# EAGLE design STorM32 NT mpu module v007-mpu6000 (EAGLE 6.5.0)
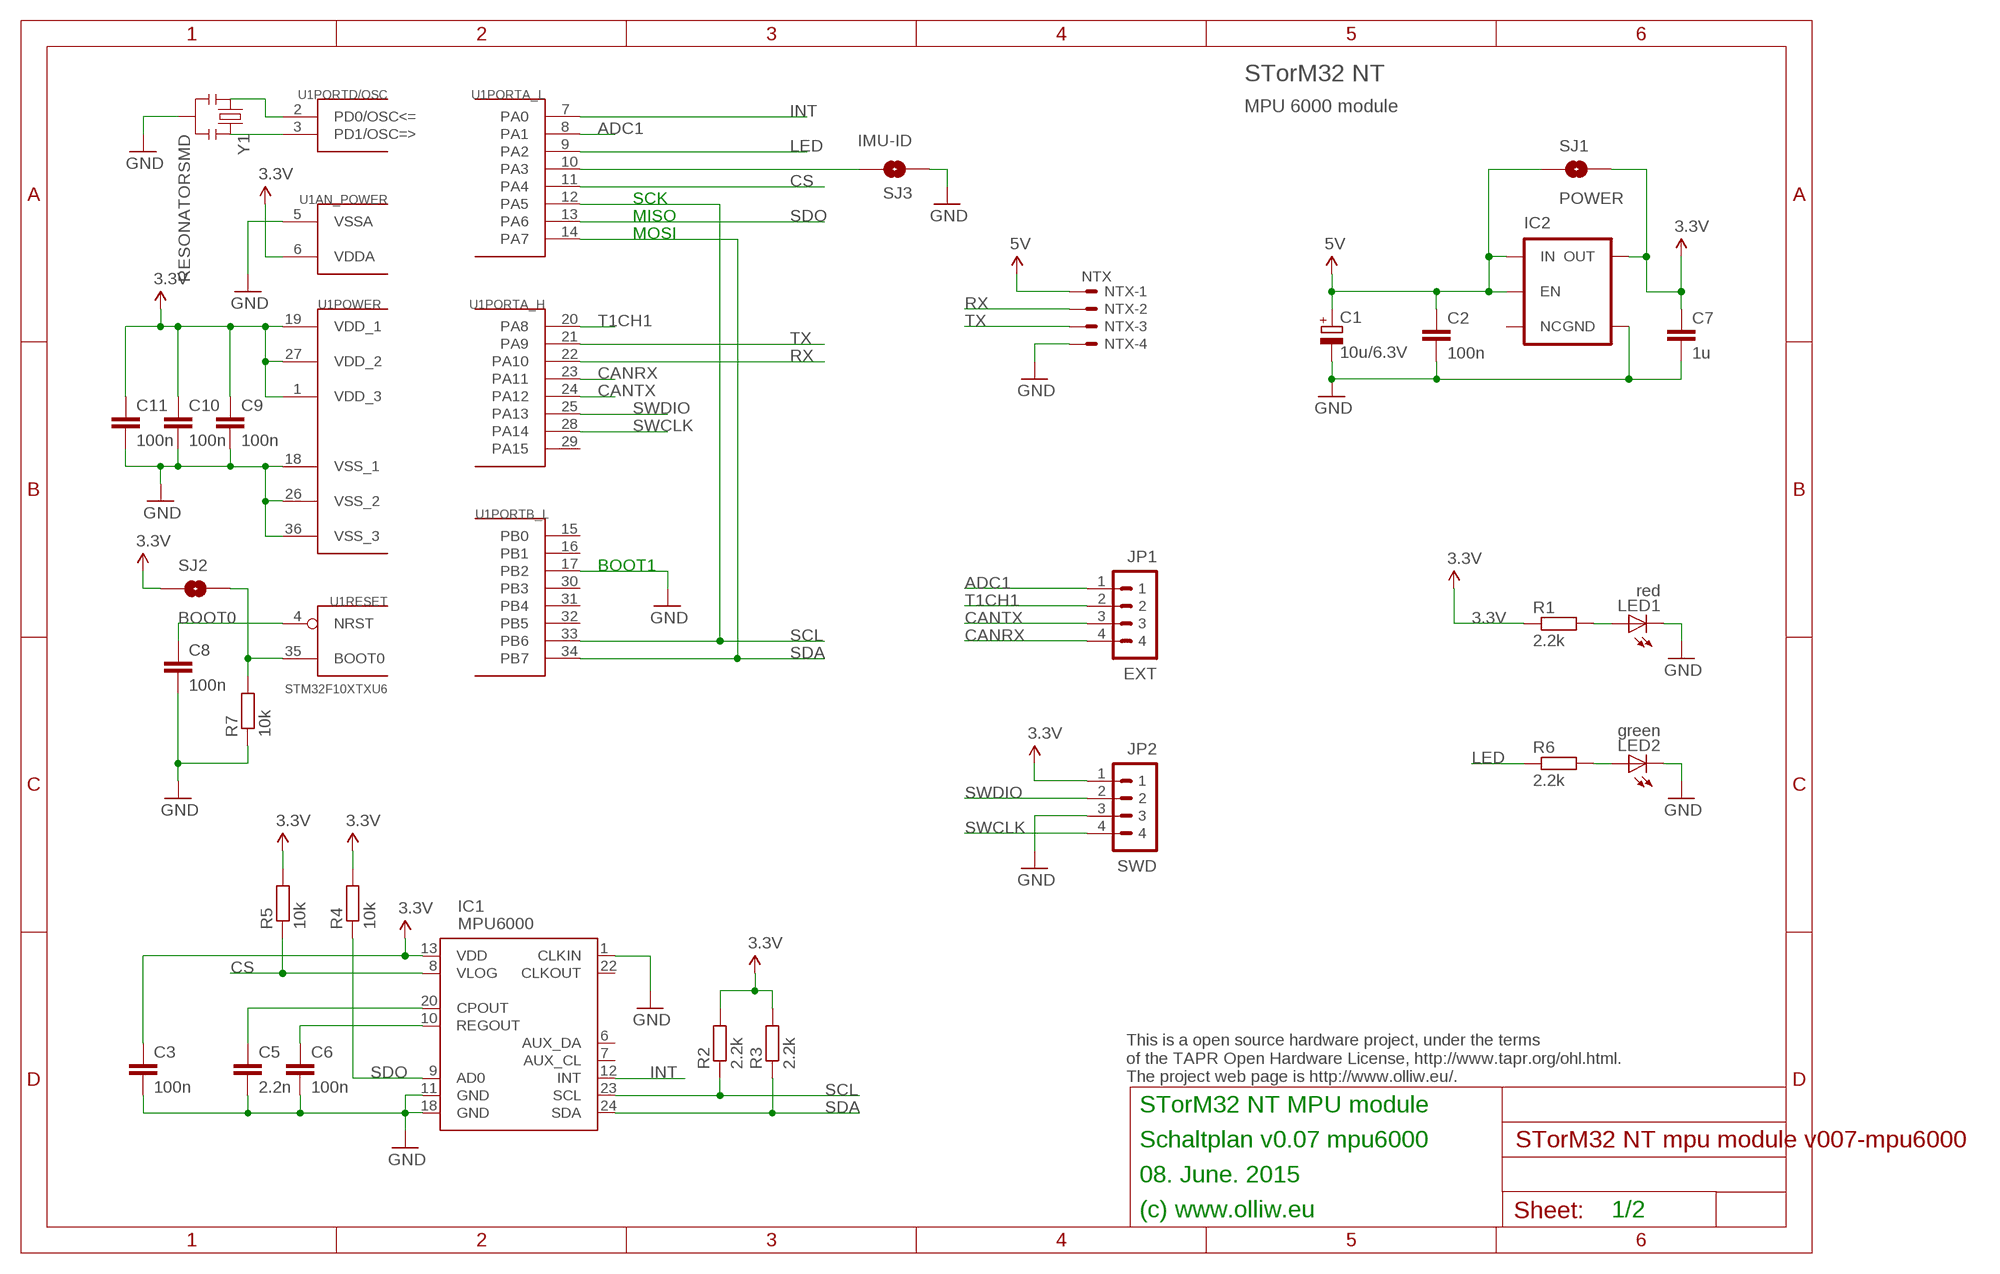
[diagram p0: schematic, sheet 1]

## Parts
C1  10u/6.3V  CPOL-EUSMCB  [SMC_B]
C2  100n  C-EUC0603  [C0603]
C3  100n  C-EUC0603  [C0603]
C5  2.2n  C-EUC0603  [C0603]
C6  100n  C-EUC0603  [C0603]
C7  1u  C-EUC0603  [C0603]
C8  100n  C-EUC0402  [C0402]
C9  100n  C-EUC0603  [C0603]
C10  100n  C-EUC0402  [C0402]
C11  100n  C-EUC0603  [C0603]
IC1  MPU6000  IMU3000  [QFN-24]
IC2  V_REG_TPS76433SOT23-5  [SOT23-5]
JP1  EXT  P4X1_1P27-OCT_BILEX  [4X1_1P27_OCT_BILEX]
JP2  SWD  P4X1_1P27-OCT_BILEX  [4X1_1P27_OCT_BILEX]
LED1  red  LEDCHIPLED_0603  [CHIPLED_0603]
LED2  green  LEDCHIPLED_0603  [CHIPLED_0603]
NTX  NTX  SM04B-SRSS-TB  [SM04B-SRSS-TB]
R1  2.2k  R-EU_R0603  [R0603]
R2  2.2k  R-EU_R0603  [R0603]
R3  2.2k  R-EU_R0603  [R0603]
R4  10k  R-EU_R0603  [R0603]
R5  10k  R-EU_R0603  [R0603]
R6  2.2k  R-EU_R0603  [R0603]
R7  10k  R-EU_R0603  [R0603]
SJ1  POWER  SOLDERJUMPERNO  [SJ_2S-NO]
SJ2  BOOT0  SOLDERJUMPERNO  [SJ_2S-NO]
SJ3  IMU-ID  SOLDERJUMPERNO  [SJ_2S-NO]
U1  STM32F10XTXU6  [VFQFPN36]
Y1  RESONATORSMD  [RESONATOR-SMD]

## Nets
3.3V: C3.1 C7.1 C9.1 C10.1 C11.1 IC1.13(VDD) IC2.5(OUT) JP2.1 R1.1 R2.2 R3.2 R4.2 R5.2 SJ1.2 SJ2.1 U1.1(POWER:VDD_3) U1.6(AN_POWER:VDDA) U1.19(POWER:VDD_1) U1.27(POWER:VDD_2)
5V: C1.+ C2.1 IC2.1(IN) IC2.3(EN) NTX.1 SJ1.1
ADC1: JP1.1 U1.8(PORTA_L:PA1)
CANRX: JP1.4 U1.23(PORTA_H:PA11)
CANTX: JP1.3 U1.24(PORTA_H:PA12)
CS: IC1.8(VLOG) R5.1 U1.11(PORTA_L:PA4)
GND: C1.- C2.2 C3.2 C5.2 C6.2 C7.2 C8.2 C9.2 C10.2 C11.2 IC1.1(CLKIN) IC1.11(GND) IC1.18(GND) IC2.2(GND) JP2.3 LED1.C LED2.C NTX.4 R7.1 SJ3.1 U1.5(AN_POWER:VSSA) U1.17(PORTB_L:PB2) U1.18(POWER:VSS_1) U1.26(POWER:VSS_2) U1.36(POWER:VSS_3) Y1.2
INT: IC1.12(INT) U1.7(PORTA_L:PA0)
LED: R6.1 U1.9(PORTA_L:PA2)
N$1: C8.1 U1.4(RESET:NRST)
N$2: LED2.A R6.2
N$3: R7.2 SJ2.2 U1.35(RESET:BOOT0)
N$5: U1.2(PORTD/OSC:PD0/OSC<=) Y1.1
N$6: U1.3(PORTD/OSC:PD1/OSC=>) Y1.3
N$9: LED1.A R1.2
N$20: C6.1 IC1.10(REGOUT)
N$24: C5.1 IC1.20(CPOUT)
RX: NTX.2 U1.22(PORTA_H:PA10)
RX2: SJ3.2 U1.10(PORTA_L:PA3)
SCL: IC1.23(SCL) R2.1 U1.12(PORTA_L:PA5) U1.33(PORTB_L:PB6)
SDA: IC1.24(SDA) R3.1 U1.14(PORTA_L:PA7) U1.34(PORTB_L:PB7)
SDO: IC1.9(AD0) R4.1 U1.13(PORTA_L:PA6)
SWCLK: JP2.4 U1.28(PORTA_H:PA14)
SWDIO: JP2.2 U1.25(PORTA_H:PA13)
T1CH1: JP1.2 U1.20(PORTA_H:PA8)
TX: NTX.3 U1.21(PORTA_H:PA9)
Unconnected: IC1.6(AUX_DA) IC1.7(AUX_CL) IC1.22(CLKOUT) IC2.4(NC) U1.15(PORTB_L:PB0) U1.16(PORTB_L:PB1) U1.29(PORTA_H:PA15) U1.30(PORTB_L:PB3) U1.31(PORTB_L:PB4) U1.32(PORTB_L:PB5)

## Notes on the sheet
- STorM32 NT
- MPU 6000 module
- SCK
- MISO
- MOSI
- BOOT1
- This is a open source hardware project, under the terms
  of the TAPR Open Hardware License, http://www.tapr.org/ohl.html.
  The project web page is http://www.olliw.eu/.
- STorM32 NT MPU module
- Schaltplan v0.07 mpu6000
- 08. June. 2015
- (c) www.olliw.eu | 1/2

## Library data of the parts
C1 = rcl:CPOL-EU: POLARIZED CAPACITOR, European symbol
C2 C3 C5-C11 = rcl:C-EU: CAPACITOR, European symbol
IC1 = # SparkFun2:IMU3000
IC2 = # SparkFun2:V_REG_TPS76433: Voltage Regulator Older TI part. LDO 150mA regulator. No output by-pass cap option. See V_REG_LDO for a better part.
JP1 JP2 = # stdlib:P4X1_1P27
LED1 LED2 = led:LED: LED OSRAM: - CHIPLED LG R971, LG N971, LY N971, LG Q971, LY Q971, LO R971, LY R971 LH N974, LH R974 LS Q976, LO Q976, LY Q976 LO Q996 - Hyper CHIPLED LW Q18S LB Q993, LB Q99A, LB R99A - SideLED LS A670, LO A670, LY A670, LG A670, LP A670 LB A673, LV A673, LT A673, LW A673 LH A674 LY A675 LS A676, LA A676, LO A676, LY A676, LW A676 LS A679, LY A679, LG A679 - Hyper Micro SIDELED® LS Y876, LA Y876, LO Y876, LY Y876 LT Y87S - SmartLED LW L88C, LW L88S LB L89C, LB L89S, LG L890 LS L89K, LO L89K, LY L89K LS L896, LA L896, LO L896, LY L896 - TOPLED LS T670, LO T670, LY T670, LG T670, LP T670 LSG T670, LSP T670, LSY T670, LOP T670, LYG T670 LG T671, LOG T671, LSG T671 LB T673, LV T673, LT T673, LW T673 LH T674 LS T676, LA T676, LO T676, LY T676, LB T676, LH T676, LSB T676, LW T676 LB T67C, LV T67C, LT T67C, LS T67K, LO T67K, LY T67K, LW E67C LS E67B, LA E67B, LO E67B, LY E67B, LB E67C, LV E67C, LT E67C LW T67C LS T679, LY T679, LG T679 LS T770, LO T770, LY T770, LG T770, LP T770 LB T773, LV T773, LT T773, LW T773 LH T774 LS E675, LA E675, LY E675, LS T675 LS T776, LA T776, LO T776, LY T776, LB T776 LHGB T686 LT T68C, LB T68C - Hyper Mini TOPLED® LB M676 - Mini TOPLED Santana® LG M470 LS M47K, LO M47K, LY M47K Source: http://www.osram.convergy.de LUXEON: - LUMILED® LXK2-PW12-R00, LXK2-PW12-S00, LXK2-PW14-U00, LXK2-PW14-V00 LXK2-PM12-R00, LXK2-PM12-S00, LXK2-PM14-U00 LXK2-PE12-Q00, LXK2-PE12-R00, LXK2-PE12-S00, LXK2-PE14-T00, LXK2-PE14-U00 LXK2-PB12-K00, LXK2-PB12-L00, LXK2-PB12-M00, LXK2-PB14-N00, LXK2-PB14-P00, LXK2-PB14-Q00 LXK2-PR12-L00, LXK2-PR12-M00, LXK2-PR14-Q00, LXK2-PR14-R00 LXK2-PD12-Q00, LXK2-PD12-R00, LXK2-PD12-S00 LXK2-PH12-R00, LXK2-PH12-S00 LXK2-PL12-P00, LXK2-PL12-Q00, LXK2-PL12-R00 Source: www.luxeon.com KINGBRIGHT: KA-3528ASYC Source: www.kingbright.com
NTX = con-jst2:?M04B-SRSS-TB: Disconnectable Crimp style connector, 1.0mm pitch 4 contacts
R1-R7 = rcl:R-EU_: RESISTOR, European symbol
SJ1-SJ3 = # SparkFun2:SOLDERJUMPER: Solder Jumper Standard SMD solder jumper. Used to automate production. Two varients : Normally Open and Normally Closed are the same, but have different paste layers. NC will have a large amount of paste and should jumper during reflow.
U1 = # stm32:STM32F10XTXU6: STM32F101/103 36pad VFQPFN36
Y1 = # SparkFun2:RESONATOR: Resonator Small SMD resonator. This is the itty bitty 10/20MHz resonators with built in caps. CSTCE10M0G55 and CSTCE20M0V53. Footprint has been reviewed closely but hasn't been tested yet.

## Board
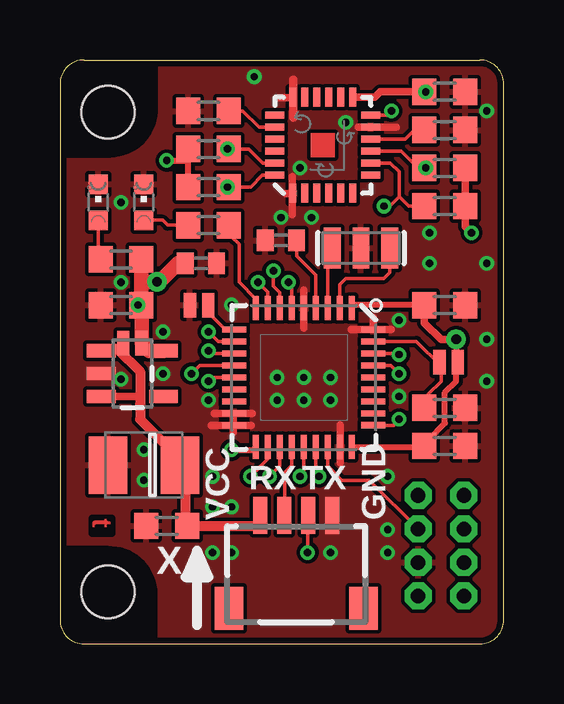
[diagram p1: board, top side]
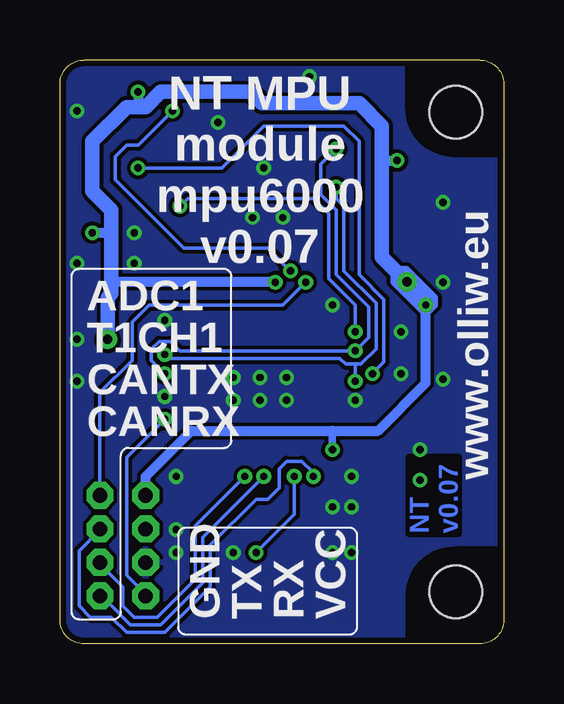
[diagram p2: board, bottom side, seen from below]

Size 18.49 x 24.35 mm. Coordinates in mm from the lower left corner, seen from the top.
Outline: 1,24.35 17.49,24.35 arc-90 18.49,23.35 18.49,1 arc-90 17.49,0 1,0 arc-90 0,1 0,23.35 arc-90 1,24.35
Copper layers (1*16): Top 0.035mm / dielectric 1.5mm / Bottom 0.035mm
Design rules "Fusion_eagle_rule_v1.1-shapes-supply-changed": minimum track width 6mil, minimum drill 12mil, track to track 6mil, track to pad 6mil, pad to pad 6mil, via to via 6mil, smd to smd 0mil, copper to edge 10mil, drill to drill 10mil, minimum pad ring 10mil, minimum via ring 6mil, stop-mask expansion 2mil, vias tented up to drill 100mil, thermal gap 6mil
Holes 2.2 mm at 2,2.17 2,22.18

### Footprints (pad centres in the part's own frame; a part is rotated, then mirrored left to right if it is on the bottom)
SMC_B = smd 1.6 x 2.4: + -1.5,0; - 1.5,0
C0603 = smd 1 x 1.1: 1 -0.85,0; 2 0.85,0
C0402 = smd 0.7 x 0.9: 1 -0.65,0; 2 0.65,0
QFN-24 = smd 0.8 x 0.3: 1 -2,1.25; 2 -2,0.75; 3 -2,0.25; 4 -2,-0.25; 5 -2,-0.75; 6 -2,-1.25; 13 2,-1.25; 14 2,-0.75; 15 2,-0.25; 16 2,0.25; 17 2,0.75; 18 2,1.25 | smd 0.3 x 0.8: 7 -1.25,-2; 8 -0.75,-2; 9 -0.25,-2; 10 0.25,-2; 11 0.75,-2; 12 1.25,-2; 19 1.25,2; 20 0.75,2; 21 0.25,2; 22 -0.25,2; 23 -0.75,2; 24 -1.25,2
SOT23-5 = smd 0.55 x 1.2: 1 -0.95,-1.3; 2 0,-1.3; 3 0.95,-1.3; 4 0.95,1.3; 5 -0.95,1.3
4X1_1P27_OCT_BILEX = drill 0.61 pad 1.118 octagon: 1 0,0; 2 0,-1.397; 3 0,-2.794; 4 0,-4.191
CHIPLED_0603 = smd 0.8 x 0.8: A 0,-0.75; C 0,0.75
SM04B-SRSS-TB = smd 0.6 x 1.55: 1 -1.5,2.975; 2 -0.5,2.975; 3 0.5,2.975; 4 1.5,2.975 | smd 1.2 x 1.8: FIT@1 -2.8,-0.9; FIT@2 2.8,-0.9
R0603 = smd 1 x 1.1: 1 -0.85,0; 2 0.85,0
SJ_2S-NO = smd 0.508 x 1.016: 1 -0.381,0; 2 0.381,0
VFQFPN36 = smd 1 x 0.25: 1 -2.9,2; 2 -2.9,1.5; 3 -2.9,1; 4 -2.9,0.5; 5 -2.9,0; 6 -2.9,-0.5; 7 -2.9,-1; 8 -2.9,-1.5; 9 -2.9,-2; 19 2.9,-2; 20 2.9,-1.5; 21 2.9,-1; 22 2.9,-0.5; 23 2.9,0; 24 2.9,0.5; 25 2.9,1; 26 2.9,1.5; 27 2.9,2 | smd 0.25 x 1: 10 -2,-2.9; 11 -1.5,-2.9; 12 -1,-2.9; 13 -0.5,-2.9; 14 0,-2.9; 15 0.5,-2.9; 16 1,-2.9; 17 1.5,-2.9; 18 2,-2.9; 29 1.5,2.9; 30 1,2.9; 31 0.5,2.9; 32 0,2.9; 33 -0.5,2.9; 34 -1,2.9; 35 -1.5,2.9; 36 -2,2.9 | smd 0.27 x 1: 28 2,2.9
RESONATOR-SMD = smd 0.7 x 1.7: 1 -1.2,0; 2 0,0; 3 1.2,0

### Placement (x,y rotation side)
C1  3.49,7.46 180 top
C2  4.45,4.92 180 top
C3  16.03,23.02 0 top
C5  6.19,22.23 180 top
C6  16.03,21.43 0 top
C7  2.54,14.13 180 top
C8  9.21,16.83 180 top
C9  16.03,8.26 0 top
C10  5.87,15.88 0 top
C11  16.03,14.13 0 top
IC1  10.95,20.8 90 top
IC2  3.02,11.27 270 top
JP1  16.83,6.19 0 top
JP2  14.92,6.19 0 top
LED1  1.59,18.41 0 top
LED2  3.49,18.41 0 top
NTX  9.84,2.38 0 top
R1  2.54,16.03 180 top
R2  6.19,20.64 180 top
R3  6.19,19.05 180 top
R4  16.03,19.84 0 top
R5  16.03,18.26 0 top
R6  6.19,17.46 180 top
R7  16.03,9.84 180 top
SJ1  3.02,12.54 0 top
SJ2  16.19,11.75 180 top
SJ3  5.79,14.13 0 top
U1  10.16,11.11 270 top
Y1  12.54,16.51 180 top

### Tracks (layer width: path | path; a pad name or v marks a point on that pad's centre or on a via)
3.3V  (via drill 0.3, 0.4 pad 0.81)
  Top 0.152: 12.2,14.13 U1.1 | 15.34,8.21 C9.1 | 3.4,14.44 C7.1 | 16.51,11.34 SJ2.1 16.51,12 | 8.04,8.1 U1.19 | U1.6 9.66,14.95 v9.53,15.08 | 3.4,15.1 3.39,15.24 | C3.1 v15.24,23.02
  Top 0.254: C11.1 12.2,14.13 | U1.27 15.34,8.21 15.34,8.52 16.03,9.21 16.03,10.48 16.51,10.95 16.51,11.34 16.51,12 v16.51,12.7 | R3.2 R2.2 5.24,20.32 5.24,20.16 v4.45,20.16 | v7.14,8.1 8.04,8.1
  Top 0.305: IC1.13 13.11,22.8 13.34,23.02 C3.1 | C11.1 15.18,13.39 15.88,12.7 v16.51,12.7 | v17.14,17.14 16.88,17.41 R5.2 R4.2
  Top 0.406: C7.1 v3.25,14.13
  Top 0.61: 3.4,14.44 SJ1.2 3.72,12.22 IC2.5 | C7.1 3.39,15.24 R1.1 | 3.4,15.1 v4.04,15.1 4.13,15.08 4.94,15.89 C10.1
  Bottom 0.254: 4.6,15.08 3.33,13.81 3.17,13.81 2.86,14.13 2.86,14.45 4.05,15.64 4.6,15.64 4.6,15.08 | 4.6,15.08 4.52,15.16 4.1,15.16 v4.04,15.1 v4.04,15.09 | 2.94,14.29 3.02,14.29 3.89,15.16 3.97,15.16 v4.04,15.09 | v4.04,15.09 4.21,14.92 3.17,13.89 3.17,14.29 3.25,14.37
  Bottom 0.305: v7.14,8.1 7.14,8.89
  Bottom 0.406: v4.04,15.1 3.25,14.31 3.25,10.87 5.24,8.89 7.14,8.89 13.02,8.89 14.92,6.99 JP2.1 | 5.08,20.16 v4.45,20.16 | v15.24,23.02 15.24,22.38 | v17.14,17.14 16.35,17.14 | v9.53,15.08 16.35,15.08
  Bottom 0.61: v4.04,15.1 5.08,16.14 5.08,20.16 5.08,21.59 6.03,22.54 10.08,22.54 10.56,23.02 14.29,23.02 14.92,22.38 15.24,22.38 15.72,22.38 17.14,20.95 17.14,18.89 16.35,18.1 16.35,17.14 16.35,15.08 16.35,14.61 16.51,14.45 v16.51,12.7
  pour Bottom (isolate 0.254, rank 2): 1.11,13.18 1.11,12.38 1.75,12.38 1.75,13.18
5V
  Top 0.152: C2.1 5.24,4.76 | 5.24,7.85 C1.+ 4.92,7.37 4.92,7.78 | 3.33,10.32 3.33,10 | 2.38,12.3 2.54,12.45 SJ1.1 | 8.26,4.92 8.41,4.92 | 8.26,5.11 NTX.1
  Top 0.305: IC2.3 3.33,10.32 | 8.41,4.92 8.26,5.11
  Top 0.406: 5.24,4.76 5.24,7.85 | IC2.1 2.38,12.3 3.33,11.35 3.33,10 3.33,9.37 4.92,7.78 | C2.1 8.26,4.92
ADC1  (via drill 0.3)
  Top 0.152: U1.8 8.66,14.68 v8.26,15.08
  Bottom 0.152: v8.26,15.08 9.21,14.13 14.76,14.13 15.48,13.41 15.48,11.83 16.83,10.48 JP1.1
CANRX  (via drill 0.3)
  Top 0.152: v10,6.99 10.16,7.14 U1.23
  Bottom 0.152: v10,6.99 12.54,4.45 12.54,2.54 14.29,0.79 15.56,0.79 16.51,1.75 16.73,1.75 JP1.4
CANTX  (via drill 0.3)
  Top 0.152: U1.24 10.66,7.12 v10.79,6.99
  Bottom 0.152: v10.79,6.99 12.86,4.92 12.86,2.7 14.45,1.11 15.4,1.11 15.88,1.59 15.88,2.38 16.73,3.24 JP1.3
CS  (via drill 0.3)
  Top 0.152: U1.11 6.6,12.61 v6.19,13.02 | IC1.8 13.77,20.05 14.13,19.68 14.13,18.65 | R5.1 14.53,18.26 14.13,18.65 | v13.49,18.26 13.73,18.26 14.13,18.65
  Bottom 0.152: v6.19,13.02 6.19,14.13 7.3,15.24 7.3,17.94 7.94,18.57 13.18,18.57 v13.49,18.26
GND  (via drill 0.3 pad 0.61)
  Top 0.152: U1.17 7.26,9.48 7.22,9.45
  Top 0.305: 10.16,14.76 10.16,13.18 | 13.81,13.11 12.14,13.11 | 6.43,9.6 8.02,9.6 | 6.31,9.12 7.98,9.12 | 11.67,9.13 11.67,7.54 | 9.68,19.49 9.68,18.77 | 9.68,18.77 9.68,17.9 | 12.42,21.55 14.01,21.55 | 9.41,18.77 9.68,18.77 | 9.09,22.78 9.68,22.78 | 13.06,13.18 13.06,13.61 | 7.22,8.81 7.22,9.45
  Top 0.356: 9.72,21.95 9.72,23.54
  other vias: 2.54,15.08 9.05,11.11 11.27,11.11 10.16,11.11 9.05,10.16 10.16,10.16 11.27,10.16 7.14,14.13 10,19.84 11.91,21.75 13.65,6.99 6.35,6.99 3.49,8.1 3.49,6.83 2.54,18.41 13.65,3.81 14.13,10.32 11.27,3.81 7.14,3.81 6.35,3.81 4.29,11.27 15.4,17.14 15.4,15.88 17.78,15.88 7.14,5.71 6.35,5.71 6.19,10.16 13.65,4.76 17.78,12.7 17.78,10.95 4.29,13.02 2.54,11.03 17.78,22.23 8.1,23.65 9.21,17.78 10.48,17.78 14.13,13.49
  pour Bottom (isolate 0.152): 0.33,23.35 arc-90 1,24.02 17.49,24.02 arc-90 18.16,23.35 18.16,1 arc-90 17.49,0.33 1,0.33 arc-90 0.33,1
  pour Top (isolate 0.152): 0.33,23.35 arc-90 1,24.02 17.49,24.02 arc-90 18.16,23.35 18.16,1 arc-90 17.49,0.33 1,0.33 arc-90 0.33,1
  cutout Bottom: 0.27,20.31 2.12,20.31 arc90 4.08,22.37 4.08,24.12 1.02,24.12 arc90 0.27,23.37
  cutout Top: 0.27,20.31 2.12,20.31 arc90 4.08,22.37 4.08,24.12 1.02,24.12 arc90 0.27,23.37
  cutout Bottom: 4.06,0.25 4.06,2.1 arc90 2,4.06 0.25,4.06 0.25,1 arc90 1,0.25
  cutout Top: 4.06,0.25 4.06,2.1 arc90 2,4.06 0.25,4.06 0.25,1 arc90 1,0.25
  pour Top (no thermals): 10.95,6.35 11.91,6.35 11.91,4.13 10.95,4.13
  pour Top (no thermals): 0.95,11.75 2.54,11.75 2.54,10.87 0.95,10.87
INT  (via drill 0.3)
  Top 0.152: U1.7 9.16,14.65 8.89,14.92 v8.89,15.56 | IC1.12 13.67,22.05 v13.81,22.23
  Bottom 0.152: v13.81,22.23 15.24,20.8 15.72,20.8 16.19,20.32 16.19,19.37 13.34,16.51 9.84,16.51 v8.89,15.56
LED
  Top 0.152: U1.9 8.16,14.38 7.46,15.08 7.46,16.67 7.14,16.99 7.14,17.36 R6.1
N$1
  Top 0.152: U1.4 10.66,15.38 9.86,16.18 C8.1
N$2
  Top 0.152: 3.54,17.94 LED2.A 4.29,17.66 4.49,17.46 R6.2
N$3
  Top 0.152: U1.35 14.85,12.61 15.88,11.59 | 15.88,11.59 SJ2.2 | R7.2 15.34,10.42 15.88,10.95 15.88,11.59
N$5
  Top 0.152: U1.2 11.66,14.99 11.91,15.24 13.49,15.24 13.74,15.49 Y1.1
N$6
  Top 0.152: U1.3 11.16,15.99 11.34,16.28 Y1.3
N$9
  Top 0.152: LED1.A 1.59,16.3 R1.2
N$20
  Top 0.152: IC1.10 14.38,21.05 14.76,21.43 C6.1
N$24
  Top 0.152: IC1.20 8.3,21.55 7.62,22.23 C5.1
RX
  Top 0.152: U1.22 9.66,7.44 9.37,7.14 9.37,5.22 NTX.2
RX2
  Top 0.152: U1.10 6.89,13.11 6.17,13.83 SJ3.2
SCL  (via drill 0.3)
  Top 0.152: U1.33 13.79,11.61 v14.13,11.27 | U1.12 6.3,12.11 v6.19,12.22 | v6.99,20.64 R2.1 7.86,20.64 8.45,20.05 IC1.23
  Bottom 0.152: v14.13,11.27 14.68,11.83 14.68,12.3 14.37,12.62 13.89,12.62 13.49,12.22 v6.19,12.22 5.64,12.78 5.64,14.05 6.99,15.4 6.99,18.1 7.62,18.73 7.62,20 v6.99,20.64
SDA  (via drill 0.3)
  Top 0.152: IC1.24 8.43,19.55 7.94,19.05 R3.1 v6.99,19.05 | U1.34 14.08,12.11 v14.13,12.06 | U1.14 6.35,11.11 v6.19,10.95
  Bottom 0.152: v14.13,12.06 13.97,11.91 6.83,11.91 6.59,11.67 6.19,11.67 | 6.19,11.67 5.95,11.67 5.32,12.3 5.32,14.21 6.67,15.56 6.67,18.26 6.99,18.57 v6.99,19.05 | v6.19,10.95 6.19,11.67
SDO  (via drill 0.3)
  Top 0.152: IC1.9 14.22,20.55 14.92,19.84 R4.1 15.24,19.9 v15.24,19.84 | U1.13 5.82,11.61 v5.48,11.27
  Bottom 0.152: v5.48,11.27 5,11.75 5,14.37 6.03,15.4 6.03,20.95 6.67,21.59 10,21.59 11.75,19.84 v15.24,19.84
SWCLK  (via drill 0.3)
  Top 0.152: U1.28 13.91,9.11 v14.13,9.37
  Bottom 0.152: JP2.4 14.92,2.06 15.72,2.86 15.72,7.78 v14.13,9.37
SWDIO
  Top 0.152: U1.25 11.16,7.41 11.75,6.83 12.89,6.83 JP2.2
T1CH1  (via drill 0.3)
  Top 0.152: v7.94,6.99 8.66,7.71 U1.20
  Bottom 0.152: JP1.2 16.83,4.76 17.7,3.89 17.7,1.59 17.22,1.11 16.35,1.11 15.72,0.48 14.13,0.48 12.22,2.38 12.22,4.13 10.32,6.03 9.84,6.03 9.37,6.51 9.37,7.3 9.05,7.62 8.41,7.62 7.94,7.14 v7.94,6.99
TX  (via drill 0.3)
  Top 0.152: U1.21 9.16,7.41 v8.73,6.99 | v10.32,3.81 10.32,5.17 NTX.3
  Bottom 0.152: v8.73,6.99 8.73,5.4 v10.32,3.81

### Text on the board
Top: t
Bottom: NT / v0.07
tNames: RX | TX | VCC | GND | X
bNames: www.olliw.eu | NT MPU / module / mpu6000 / v0.07 | ADC1 | T1CH1 | CANTX | CANRX | VCC | RX | TX | GND